# Altium schematic sheet Public_CPU_Sub_Power_Supplies.SchDoc
size D
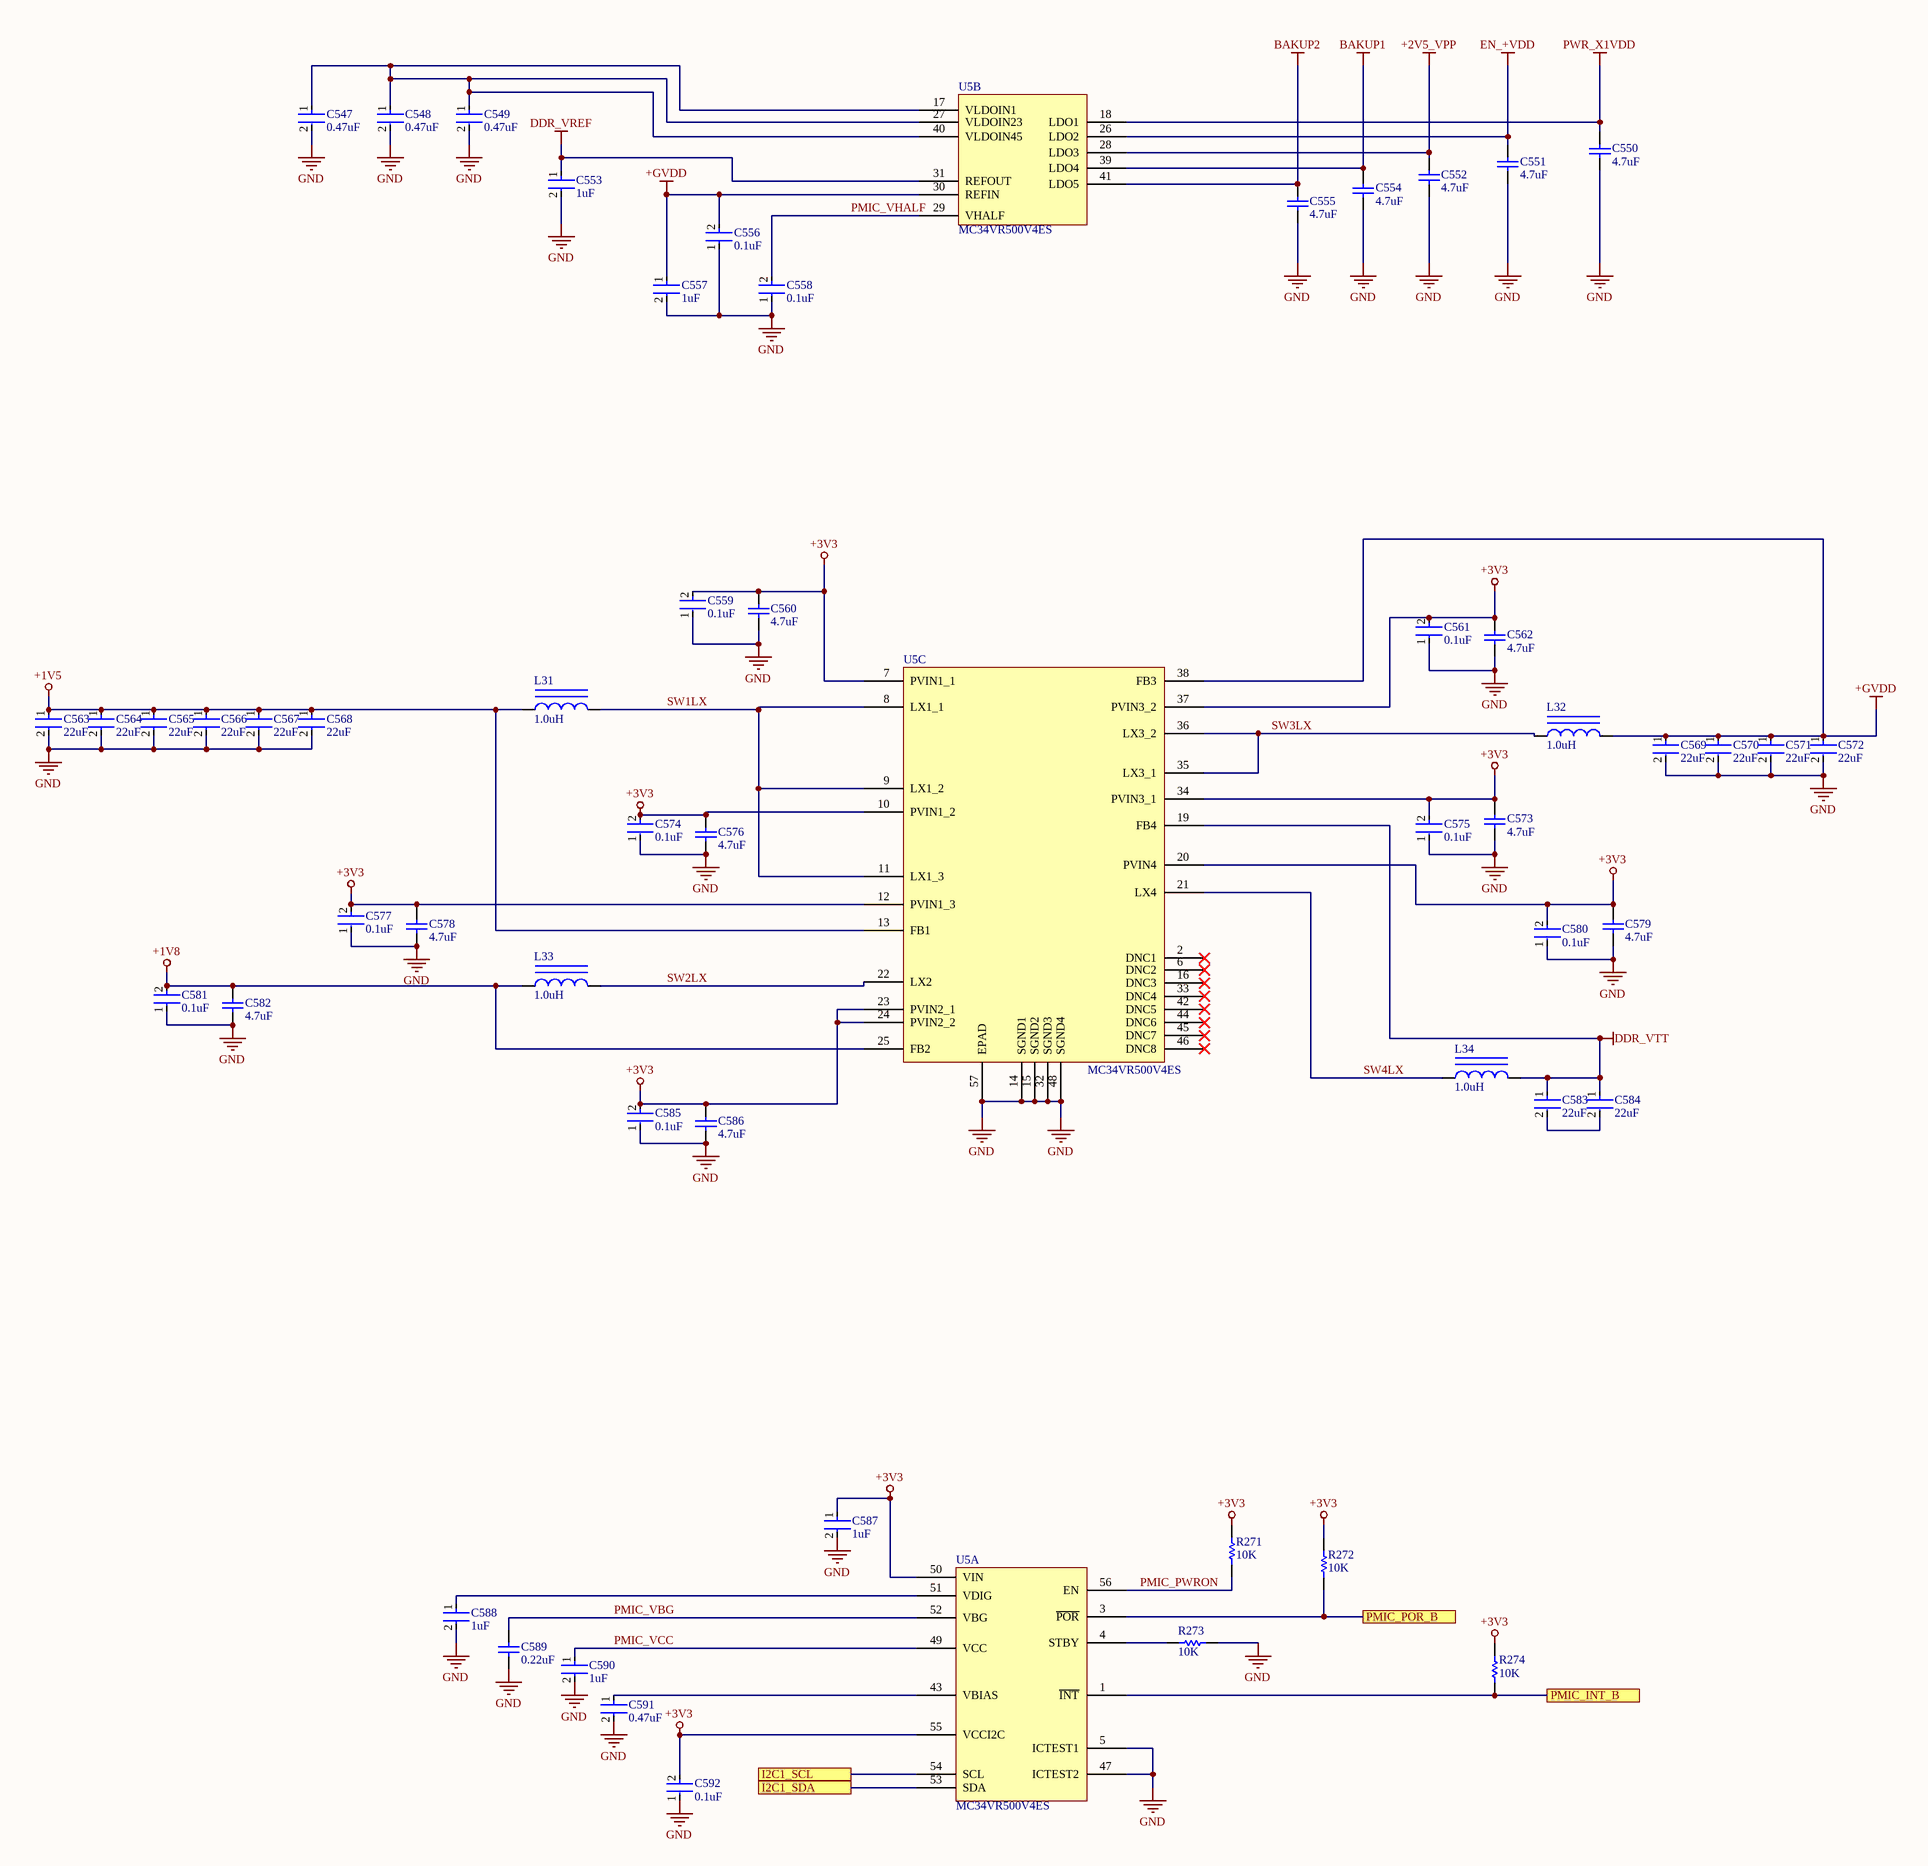
[diagram p0: Public_CPU_Sub_Power_Supplies.SchDoc]

## Parts
C547  0.47uF  [FP-GRM188-0_1-e0_2_0_5-IPC_B]
C548  0.47uF  [FP-GRM188-0_1-e0_2_0_5-IPC_B]
C549  0.47uF  [FP-GRM188-0_1-e0_2_0_5-IPC_B]
C550  4.7uF  [CAPC2013X145X50ML20T25]
C551  4.7uF  [CAPC2013X145X50ML20T25]
C552  4.7uF  [CAPC2013X145X50ML20T25]
C553  1uF  [FP-GRM15-0_1-MFG]
C554  4.7uF  [CAPC2013X145X50ML20T25]
C555  4.7uF  [CAPC2013X145X50ML20T25]
C556  0.1uF  [FP-GRM15-MFG]
C557  1uF  [FP-GRM15-0_1-MFG]
C558  0.1uF  [FP-GRM15-MFG]
C559  0.1uF  [FP-GRM15-MFG]
C560  4.7uF  [CAPC2013X145X50ML20T25]
C561  0.1uF  [FP-GRM15-MFG]
C562  4.7uF  [CAPC2013X145X50ML20T25]
C563  22uF  [FP-GRM21B-0_15-MFG]
C564  22uF  [FP-GRM21B-0_15-MFG]
C565  22uF  [FP-GRM21B-0_15-MFG]
C566  22uF  [FP-GRM21B-0_15-MFG]
C567  22uF  [FP-GRM21B-0_15-MFG]
C568  22uF  [FP-GRM21B-0_15-MFG]
C569  22uF  [FP-GRM21B-0_15-MFG]
C570  22uF  [FP-GRM21B-0_15-MFG]
C571  22uF  [FP-GRM21B-0_15-MFG]
C572  22uF  [FP-GRM21B-0_15-MFG]
C573  4.7uF  [CAPC2013X145X50ML20T25]
C574  0.1uF  [FP-GRM15-MFG]
C575  0.1uF  [FP-GRM15-MFG]
C576  4.7uF  [CAPC2013X145X50ML20T25]
C577  0.1uF  [FP-GRM15-MFG]
C578  4.7uF  [CAPC2013X145X50ML20T25]
C579  4.7uF  [CAPC2013X145X50ML20T25]
C580  0.1uF  [FP-GRM15-MFG]
C581  0.1uF  [FP-GRM15-MFG]
C582  4.7uF  [CAPC2013X145X50ML20T25]
C583  22uF  [FP-GRM21B-0_15-MFG]
C584  22uF  [FP-GRM21B-0_15-MFG]
C585  0.1uF  [FP-GRM15-MFG]
C586  4.7uF  [CAPC2013X145X50ML20T25]
C587  1uF  [FP-GRM15-0_1-MFG]
C588  1uF  [FP-GRM15-0_1-MFG]
C589  0.22uF  [CAPC1005X55X25NL05T10]
C590  1uF  [FP-GRM15-0_1-MFG]
C591  0.47uF  [FP-GRM188-0_1-e0_2_0_5-IPC_B]
C592  0.1uF  [FP-GRM15-MFG]
L31  1.0uH  [BOUR-CM45_L]
L32  1.0uH  [BOUR-CM45_L]
L33  1.0uH  [BOUR-CM45_L]
L34  1.0uH  [BOUR-CM45_L]
R271  10K  [RESC1005X40X25LL05T05]
R272  10K  [RESC1005X40X25LL05T05]
R273  10K  [RESC1005X40X25LL05T05]
R274  10K  [RESC1005X40X25LL05T05]
U5  MC34VR500V4ES  [QFN50P800X800X90-57N]  (parts A,B,C of 3)

## Ports
I2C1_SCL, I2C1_SDA, PMIC_INT_B, PMIC_POR_B

## Nets
+1V5: C563.1 C564.1 C565.1 C566.1 C567.1 C568.1 L31.1 U5.13(FB1)
+1V8: C581.2 C582.2 L33.1 U5.25(FB2)
+2V5_VPP: C552.2 U5.28(LDO3)
+3V3: C559.2 C560.2 C561.2 C562.2 C573.2 C574.2 C575.2 C576.2 C577.2 C578.2 C579.2 C580.2 C585.2 C586.2 C587.1 C592.2 R271.2 R272.2 R274.2 U5.7(PVIN1_1) U5.10(PVIN1_2) U5.12(PVIN1_3) U5.20(PVIN4) U5.23(PVIN2_1) U5.24(PVIN2_2) U5.34(PVIN3_1) U5.37(PVIN3_2) U5.50(VIN) U5.55(VCCI2C)
+GVDD: C556.2 C557.1 C569.1 C570.1 C571.1 C572.1 L32.2 U5.30(REFIN) U5.38(FB3)
BAKUP1: C554.2 U5.39(LDO4)
BAKUP2: C555.2 U5.41(LDO5)
DDR_VREF: C553.1 U5.31(REFOUT)
DDR_VTT: C583.1 C584.1 L34.2 U5.19(FB4)
EN_+VDD: C551.2 U5.26(LDO2)
GND: C547.2 C548.2 C549.2 C550.1 C551.1 C552.1 C553.2 C554.1 C555.1 C556.1 C557.2 C558.1 C559.1 C560.1 C561.1 C562.1 C563.2 C564.2 C565.2 C566.2 C567.2 C568.2 C569.2 C570.2 C571.2 C572.2 C573.1 C574.1 C575.1 C576.1 C577.1 C578.1 C579.1 C580.1 C581.1 C582.1 C585.1 C586.1 C587.2 C588.2 C589.1 C590.2 C591.2 C592.1 R273.1 U5.5(ICTEST1) U5.14(SGND1) U5.15(SGND2) U5.32(SGND3) U5.47(ICTEST2) U5.48(SGND4) U5.57(EPAD)
PWR_X1VDD: C550.2 U5.18(LDO1)
I2C1_SCL: U5.54(SCL) ; port I2C1_SCL
I2C1_SDA: U5.53(SDA) ; port I2C1_SDA
PMIC_INT_B: R274.1 U5.1(~{INT}) ; port PMIC_INT_B
PMIC_POR_B: R272.1 U5.3(~{POR}) ; port PMIC_POR_B
PMIC_PWRON: R271.1 U5.56(EN)
PMIC_VBG: C589.2 U5.52(VBG)
PMIC_VCC: C590.1 U5.49(VCC)
PMIC_VHALF: C558.2 U5.29(VHALF)
SW1LX: L31.2 U5.8(LX1_1) U5.9(LX1_2) U5.11(LX1_3)
SW2LX: L33.2 U5.22(LX2)
SW3LX: L32.1 U5.35(LX3_1) U5.36(LX3_2)
SW4LX: L34.1 U5.21(LX4)
NetC547_1: C547.1 C548.1 C549.1 U5.17(VLDOIN1) U5.27(VLDOIN23) U5.40(VLDOIN45)
NetC583_2: C583.2 C584.2
NetC588_1: C588.1 U5.51(VDIG)
NetC591_1: C591.1 U5.43(VBIAS)
NetR273_2: R273.2 U5.4(STBY)

Not connected (* = marked no-connect by the designer): U5 2(DNC1)* 6(DNC2)* 16(DNC3)* 33(DNC4)* 42(DNC5)* 44(DNC6)* 45(DNC7)* 46(DNC8)*

## Notes on the sheet
- Title
- Size:
- Date:
- File:
- D
- Number:
- Time:
- Revision:
- Sheet
- of

## Library data of the parts
C547-C549 C591 = CMP-2006-02860-2: Chip Multilayer Ceramic Capacitors for General Purpose, 0603, 0.47uF, X7R, 15%, 10%, 16V; Capacitance: 470nF; Material: Ceramic; Termination: SMD/SMT; Case Code (Imperial): 0603; Height: 0.8mm; Dielectric: X7R; Length: 1.6mm; Packaging: Tape and Reel; Mount: Surface Mount; Thickness: 0.035inch; Voltage Rating (DC): 16V; Case Code (Metric): 1608; REACH SVHC: No SVHC; Depth: 0.8mm; Number of Pins: 2; Max Operating Temperature: 125°C; Min Operating Temperature: -55°C; Width: 0.8mm; Voltage: 16V; Lead Free: Lead Free; Voltage Rating: 16V; Package Quantity: 1; Case/Package: 0603; Tolerance: 10%
C550-C552 C554 C555 C560 C562 C573 C576 C578 C579 C582 C586 = CMP-2007-01010-1: Manufacturer: Kemet; Part Number: C0805C475K3PACTU
C553 C557 C587 C588 C590 = CMP-2008-04556-2: CAP CER 1UF 10V X5R 0402; Manufacturer Part Number: GRM155R61A105KE15D; Manufacturer: Murata; Material: Ceramic; Tolerance: 10%; Temperature Coefficient: 15%; Octopart: https://octopart.com/grm155r61a105ke15d-murata-197442; Lead Free: Yes; ComponentLink2Description: Datasheet; Temperature: -55°C to +85°C; Temperature Range High: +85°C; Height: 0.55mm; Capacitance: 1uF; Ipc Land Pattern Name: CAPC10050X50; ComponentLink2URL: https://search.murata.co.jp/Ceramy/image/img/A01X/G101/ENG/GRM155R61A105KE15-01A.pdf; Temperature Range Low: -55°C; Device Class L2: Capacitors; Voltage Rating: 10V; RoHS: TRUE; Device Class L1: Passive Components; Device Class L3: Ceramic Capacitors; Temperature Characteristic: X5R; Mouser Description: 0402 1 uF 10 V ±10% Tolerance X5R Surface Mount Multilayer Ceramic Capacitor; Automotive: No; Package: GRM15-0.1; Digikey Description: CAP CER 1UF 10V X5R 0402; Value: 1uF; Category: Cap
C556 C558 C559 C561 C574 C575 C577 C580 C581 C585 C592 = CMP-2100-03641-2: CAP CER 0.1UF 16V X7R 0402; Manufacturer Part Number: GRM155R71C104KA88D; Manufacturer: Murata; Standoff Height: 0mm; Tolerance: 10%; Voltage Rating: 16Vdc; Material: Ceramic; Capacitance: 0.10μF; Value: 0.10μF; RoHS: TRUE; Temperature Characteristic: X7R; Octopart: https://octopart.com/grm155r71c104ka88d-murata-196880; Digikey Description: CAP CER 0.1UF 16V X7R 0402; Device Class L3: Ceramic Capacitors; Height: 0.55mm; ComponentLink2Description: Datasheet; Temperature Range Low: -55°C; Ipc Land Pattern Name: CAPC10050X219; ComponentLink2URL: https://search.murata.co.jp/Ceramy/image/img/A01X/G101/ENG/GRM155R71H471KA01-01A.pdf; Device Class L1: Passive Components; Lead Free: yes; Category: Cap; Package: GRM15; Temperature: -55°C to +125°C; Device Class L2: Capacitors; Temperature Range High: +125°C; Mouser Description: 0402 0.1 uF 16V ±10 % Tolerance X7R SMT Multilayer Ceramic Capacitor
C563-C572 C583 C584 = CMP-2007-03385-2: Chip Multilayer Ceramic Capacitors for General Purpose, 0805, 22uF, X5R, 15%, 20%, 6.3V; Material: Ceramic; Max Operating Temperature: 85°C; Voltage: 6.3V; Min Operating Temperature: -55°C; Case/Package: 0805; Thickness: 0.053inch; Dielectric: X5R; Packaging: Tape and Reel; Depth: 1.25mm; Termination: SMD/SMT; Voltage Rating (DC): 6.3V; Radiation Hardening: No; Tolerance: 20%; Mount: Surface Mount; Lead Free: Lead Free; Package Quantity: 1; REACH SVHC: No SVHC; Voltage Rating: 6.3V; Capacitance: 22uF; Length: 2mm; Case Code (Imperial): 0805; Case Code (Metric): 2012; Width: 0.049inch; Height: 1.25mm
C589 = CMP-2008-04561-4: Chip Capacitor, 220 nF, +/- 10%, 10 V, -55 to 85 degC, 0402 (1005 Metric), RoHS, Tape and Reel; Manufacturer: Basic Passives; PartNumber: GRM155R61A224KE19D; Case\/Package: 0402; Voltage Rating: 10 V; Type (Capacitors): X5R; Capacitance: 220 nF; Max Operating Temperature: 85 degC; Package Quantity: 1; RoHSCompliant: true; Height: 0.5 mm; Mounting Technology: Surface Mount; Case Code (Metric): 1005; ComponentLink2URL: http://search.murata.co.jp/Ceramy/image/img/A01X/G101/ENG/GRM155R61A224KE19-01.pdf; Case Code (Imperial): 0402; Length: 1 mm; Radiation Hardening: No; Tolerance: 10%; Pins: 2; ComponentLink1Description: Manufacturer URL; Voltage Rating (DC): 10 V; Width: 0.5 mm; REACH SVHC: No SVHC; ComponentLink1URL: http://www.murata.com/; Min Operating Temperature: -55 degC; DatasheetVersion: 03/2016; Mount: Surface Mount; PackageReference: 0402; Packaging: Tape and Reel; ComponentLink2Description: Datasheet; PackageDescription: 2-Pin Surface Mount Device, Body 1 x 0.5 mm
L31-L34 = CMP-2000-06114-1: Chip Inductor, 1 uH, +/- 10%, 450 mA, -40 to 125 degC, 2-Pin SMD (1812), RoHS, Tape and Reel; Manufacturer: Bourns; Nominal inductivity: 1µH; Content: 1pc(s); Nominal current: 0.45A; Type: CM453232-1R0KL; Category: Inductor; Package Description: 2-Pin Surface Mount Device, Body 4.5 x 3.2 mm; Manufacturer URL: http://www.bourns.com/; LN: 1µH; Package Reference: CM45; Mounting Technology: SurfaceMount; Datasheet URL: http://www.bourns.com/docs/Product-Datasheets/cm.pdf; Datasheet Version: 03/2016
R271-R274 = CMP-2000-07588-1: Chip Resistor, 10 KOhm, +/- 1%, 0.1 W, -55 to 155 degC, 0402 (1005 Metric), RoHS, Tape and Reel; Manufacturer: Panasonic; Power Rating: 100mW; Voltage Rating: 50V; Resistance: 10KOhm; Case\/Package: 0402; Temperature Coefficient: 100ppm\/degreesC; RoHSCompliant: True; Lead Free: LeadFree; Package Quantity: 1; Contact Plating: Tin; Length: 1mm; Radiation Hardening: No; REACH SVHC: NoSVHC; Max Operating Temperature: 155degC; Depth: 0.5mm; Case Code (Imperial): 0402; Military Standard: Not; Package Description: 2-Pin Surface Mount Device, Body 1 x 0.5 mm; Termination: SMD/SMT; Case Code (Metric): 1005; Height: 0.35mm; Packaging: TapeandReel; Voltage Rating (DC): 50V; Package Reference: 402; Number of Pins: 2; Tolerance: 1%; Mounting Technology: SurfaceMount; Width: 0.02inch; Mount: SurfaceMount; Datasheet URL: https://industrial.panasonic.com/cdbs/www-data/pdf/RDA0000/AOA0000C304.pdf; Composition: ThickFilm; Datasheet Version: 02/2017; Manufacturer URL: http://www.panasonic.com/; Max Power Dissipation: 100mW; Number of Terminations: 2; Min Operating Temperature: -55degC
U5 = MC34VR500V4ES: Regulator, Buck, Quad with up to 4.5A Output and Triple User-programmable LDOs, QFN 56, Tray; MF: {'manufacturer': u'NXP Semiconductors'}; Package: None; MP: MC34VR500V4ES; Value: *; Availability: Unavailable; Price: None